# EAGLE design mfrhp (EAGLE 7.7.0)
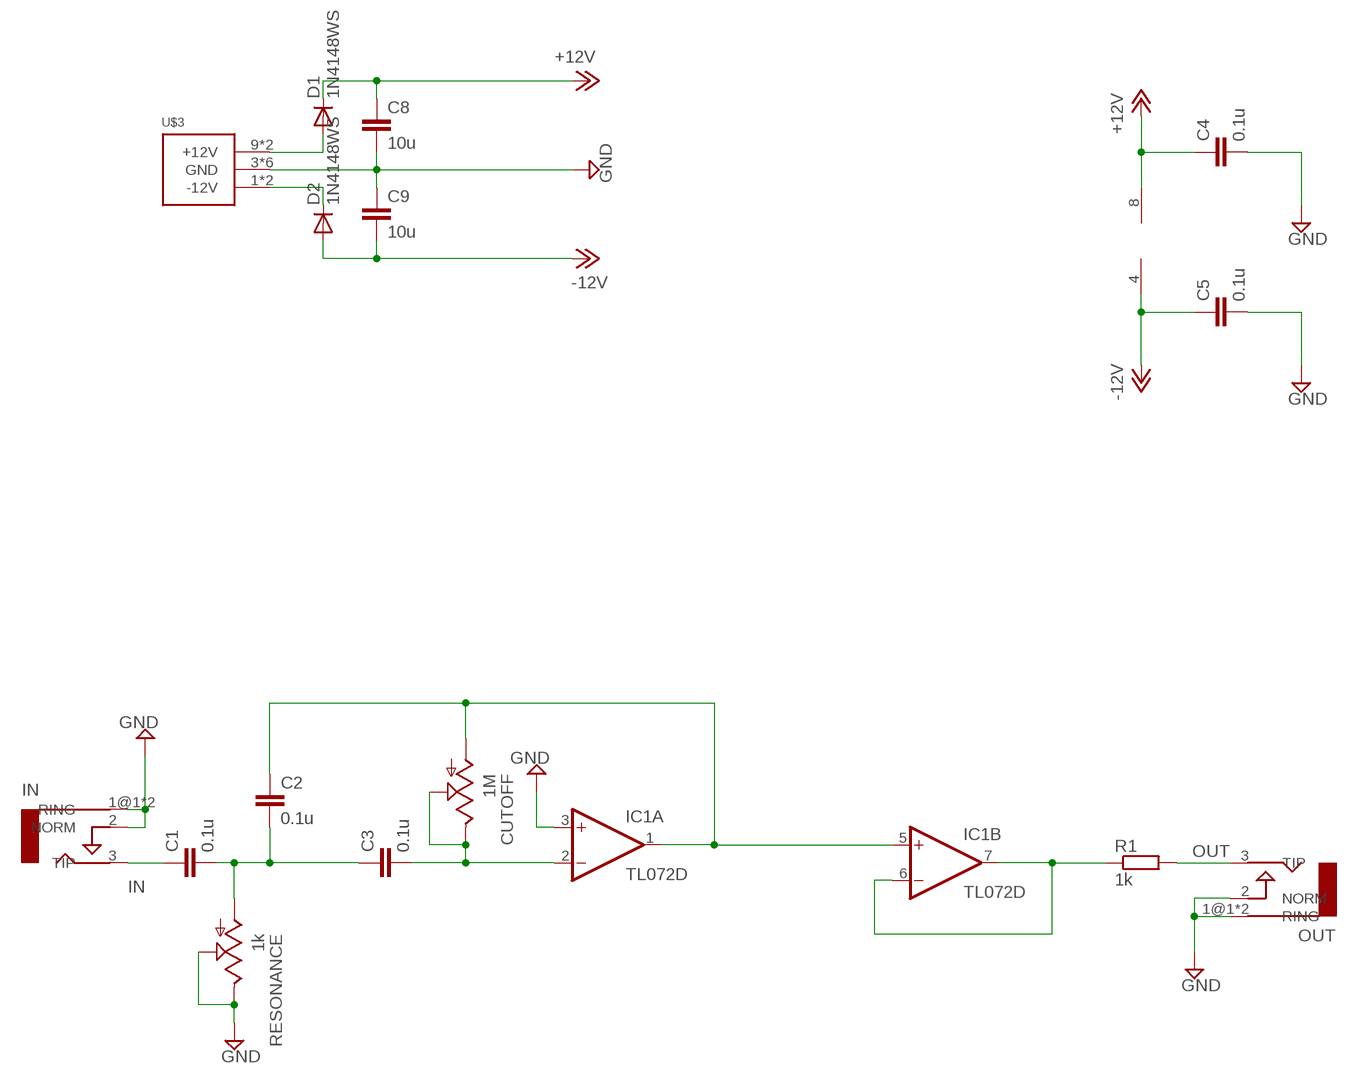
[diagram p0: schematic, sheet 1]

## Parts
C1  0.1u  C-EUC0805  [C0805]
C2  0.1u  C-EUC0805  [C0805]
C3  0.1u  C-EUC0805  [C0805]
C4  0.1u  C-EUC0805  [C0805]
C5  0.1u  C-EUC0805  [C0805]
C8  10u  C-EUC0805  [C0805]
C9  10u  C-EUC0805  [C0805]
CUTOFF  1M  9MM_SNAP-IN_POT_  [9MM_SNAP-IN_POT]
D1  1N4148WS  DIODE-SOD323-W  [SOD323-W]
D2  1N4148WS  DIODE-SOD323-W  [SOD323-W]
IC1  TL072D  [SO08]
IN  AUDIO-JACKERTHENVAR  [ERTHENVAR-JACK]
OUT  AUDIO-JACKERTHENVAR  [ERTHENVAR-JACK]
R1  1k  R-EU_R0805  [R0805]
RESONANCE  1k  9MM_SNAP-IN_POT_  [9MM_SNAP-IN_POT]
U$3  POWER_SIMPLE10  [POWER_10]

## Nets
+12V: C4.1 C8.1 D1.C IC1.8(P:V+)
-12V: C5.1 C9.2 D2.A IC1.4(P:V-)
GND: C4.2 C5.2 C8.2 C9.1 IC1.3(A:+IN) IN.1@1(RING) IN.1@2(RING) IN.2(NORM) OUT.1@1(RING) OUT.1@2(RING) OUT.2(NORM) RESONANCE.2(S) RESONANCE.3(E) U$3.3(GND) U$3.4(GND) U$3.5(GND) U$3.6(GND) U$3.7(GND) U$3.8(GND)
IN: C1.1 IN.3(TIP)
N$1: D2.C U$3.1(-12V) U$3.2(-12V)
N$2: C3.2 CUTOFF.2(S) CUTOFF.3(E) IC1.2(A:-IN)
N$3: C1.2 C2.2 C3.1 RESONANCE.1(A)
N$4: D1.A U$3.9(+12V) U$3.10(+12V)
N$6: IC1.6(B:-IN) IC1.7(B:OUT) R1.1
N$9: C2.1 CUTOFF.1(A) IC1.1(A:OUT) IC1.5(B:+IN)
OUT: OUT.3(TIP) R1.2

## Library data of the parts
C1-C5 C8 C9 = rcl:C-EU: CAPACITOR, European symbol
CUTOFF RESONANCE = MusicThingModular:9MM_SNAP-IN_POT: 9mm vertical snap-in pot, Alpha / Panasonic style
D1 D2 = diode:DIODE-: DIODE
IC1 = linear:TL072: OP AMP
IN OUT = erthenvar:AUDIO-JACK: Switching Mono 3.5mm Audio Jack from Erthenvar.
R1 = rcl:R-EU_: RESISTOR, European symbol
U$3 = eurorack:POWER_SIMPLE

## Board
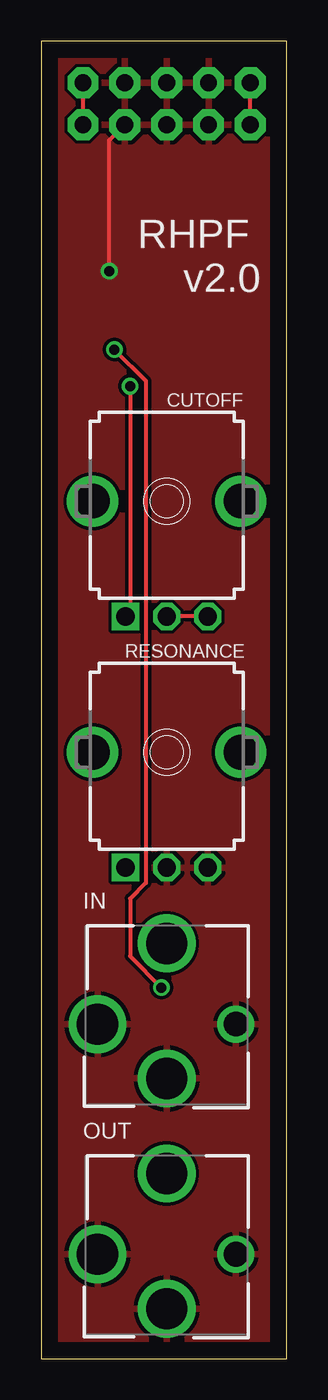
[diagram p1: board, top side]
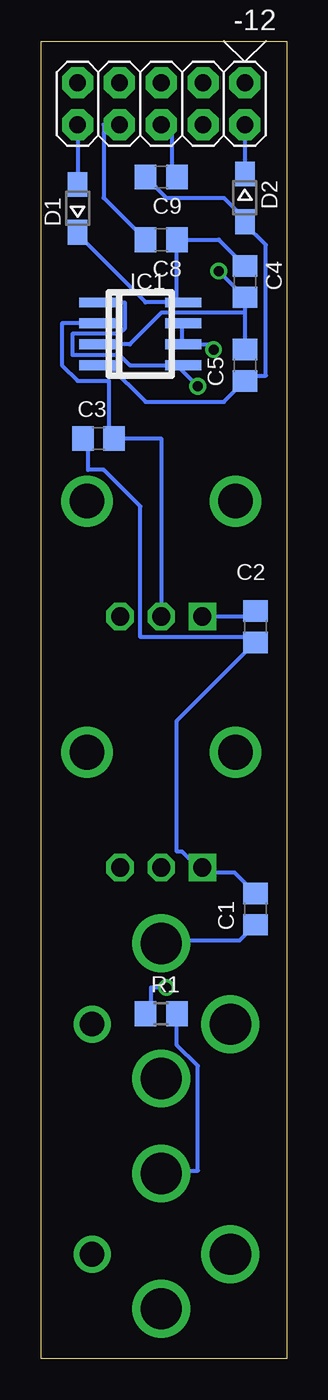
[diagram p2: board, bottom side, seen from below]

Size 14.91 x 80 mm. Coordinates in mm from the lower left corner, seen from the top.
Outline: 0,0 14.91,0 14.91,80 0,80 0,0
Copper layers (1*16): Top 0.035mm / dielectric 1.5mm / Bottom 0.035mm
Design rules "default": minimum track width 10mil, minimum drill 24mil, track to track 8mil, track to pad 8mil, pad to pad 8mil, via to via 8mil, smd to smd 8mil, copper to edge 40mil, drill to drill 8mil, minimum pad ring 10mil, minimum via ring 8mil, stop-mask expansion 4mil, vias tented up to drill 0mil, thermal gap 10mil

### Footprints (pad centres in the part's own frame; a part is rotated, then mirrored left to right if it is on the bottom)
C0805 = smd 1.3 x 1.5: 1 -0.95,0; 2 0.95,0
9MM_SNAP-IN_POT = drill 1.1 square: 1 -2.5,-7 | drill 1.1 octagon: 2 0,-7; 3 2.5,-7 | drill 2.1 pad 2.794: CHASSIS1 -4.5,0; CHASSIS2 4.5,0
SOD323-W = smd 1.5 x 1.2: A 1.45,0; C -1.45,0
SO08 = smd 0.6 x 2.2: 1 -1.905,-2.6; 2 -0.635,-2.6; 3 0.635,-2.6; 4 1.905,-2.6; 5 1.905,2.6; 6 0.635,2.6; 7 -0.635,2.6; 8 -1.905,2.6
ERTHENVAR-JACK = drill 2.5: 1@1 -4.2,0; 2 0,-3.3; 3 0,4.9 | drill 1.5: 1@2 4.2,0
R0805 = smd 1.3 x 1.5: 1 -0.95,0; 2 0.95,0
POWER_10 = drill 1.016 pad 1.88 octagon: 1 -5.08,-1.27; 2 -5.08,1.27; 3 -2.54,-1.27; 4 -2.54,1.27; 5 0,-1.27; 6 0,1.27; 7 2.54,-1.27; 8 2.54,1.27; 9 5.08,-1.27; 10 5.08,1.27

### Placement (x,y rotation side)
C1  1.91,27.3 90 bottom
C2  1.91,44.45 270 bottom
C3  11.43,55.88 0 bottom
C4  2.54,65.41 270 bottom
C5  2.54,60.33 90 bottom
C8  7.62,67.94 180 bottom
C9  7.62,71.75 180 bottom
CUTOFF  7.62,52.07 0 top
D1  12.7,69.85 90 bottom
D2  2.54,70.48 270 bottom
IC1  8.89,62.23 270 bottom
IN  7.62,20.32 0 top
OUT  7.62,6.35 0 top
R1  7.62,20.95 0 bottom
RESONANCE  7.62,36.83 0 top
U$3  7.62,76.2 180 bottom

### Tracks (layer width: path | path; a pad name or v marks a point on that pad's centre or on a via)
+12V
  Bottom 0.254: C8.1 4.13,67.94 C4.1 | 6.67,64.14 IC1.8 6.35,64.14 | 6.67,64.14 8.57,64.14 12.7,68.26 D1.C | 6.67,64.14 C8.1 | C8.1
-12V
  Bottom 0.254: C9.2 7.3,70.48 3.81,70.48 2.54,69.22 D2.A 2.54,68.9 1.27,67.63 1.27,59.69 2.54,59.69 C5.1 3.81,58.1 8.57,58.1 10.79,60.33 IC1.4
GND  (via drill 0.61)
  Top 0.254: U$3.4 4.13,73.98 v4.13,66.04
  Bottom 0.254: U$3.6 6.99,74.93 6.99,71.75 C9.1 | U$3.8 11.11,74.93 11.11,70.48 C8.2 | 2.54,63.5 C4.2 2.54,64.77 2.86,64.77 v4.13,66.04 | 2.54,63.5 C5.2 | IC1.3 9.53,61.59 7.62,63.5 2.54,63.5
  pour Top: 0,80.01 15.24,80.01 15.24,0 0,0
IN
  Bottom 0.254: C1.1 2.86,25.4 7.62,25.4 IN.3
N$1
  Top 0.254: U$3.2 U$3.1
  Bottom 0.254: U$3.2 D2.C
N$2
  Top 0.254: CUTOFF.2 7.62,45.09 9.84,45.09 CUTOFF.3
  Bottom 0.254: IC1.2 13.65,62.87 13.65,60.33 12.7,59.37 10.79,59.37 10.79,55.88 C3.2 7.62,55.88 CUTOFF.2
N$3
  Bottom 0.254: C1.2 3.17,29.53 5.08,29.53 RESONANCE.1 5.4,29.84 6.35,30.8 6.67,30.8 6.67,38.73 C2.2 1.91,43.81 8.89,43.81 8.89,51.75 11.11,53.98 12.06,53.98 12.06,55.88 C3.1
N$4
  Top 0.254: U$3.10 U$3.9
  Bottom 0.254: U$3.10 D1.A
N$6  (via drill 0.61)
  Top 0.254: v7.3,22.54 5.4,24.45 5.4,27.94 6.35,28.89 6.35,59.37 v4.45,61.28
  Bottom 0.254: v7.3,22.54 8.26,22.54 8.26,20.95 R1.1 | v4.45,61.28 4.76,61.59 IC1.6 6.35,61.59 6.35,62.87 IC1.7
N$9  (via drill 0.61)
  Top 0.254: v5.4,59.05 5.4,45.09 CUTOFF.1
  Bottom 0.254: C2.1 1.91,45.09 5.08,45.09 CUTOFF.1 | 6.67,60.33 9.53,60.33 10.16,60.96 13.02,60.96 13.02,62.23 10.16,62.23 9.84,62.55 9.84,64.14 IC1.1 | 6.67,60.33 IC1.5 6.35,60.33 | 6.67,60.33 v5.4,59.05
OUT
  Bottom 0.254: R1.2 6.67,19.05 5.4,17.78 5.4,11.43 7.62,11.43 OUT.3

### Text on the board
tNames: RHPF / v2.0